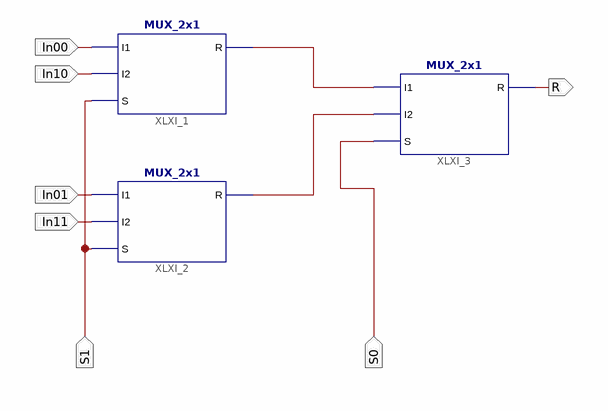
[diagram p0: schematic sheet 1]
// Xilinx ISE schematic MUX_4x1.sch (spartan3) as structural Verilog: 3 symbols, 7 ports
module MUX_4x1 (
  input  S1,
  input  S0,
  input  In00,
  input  In10,
  input  In01,
  input  In11,
  output R
);

  wire XLXN_3, XLXN_4;

  MUX_2x1 XLXI_1 (.I1(In00), .I2(In10), .S(S1), .R(XLXN_3));
  MUX_2x1 XLXI_2 (.I1(In01), .I2(In11), .S(S1), .R(XLXN_4));
  MUX_2x1 XLXI_3 (.I1(XLXN_3), .I2(XLXN_4), .S(S0), .R(R));
endmodule
